# EAGLE design ConFLiCTuino (EAGLE 6.5.0)
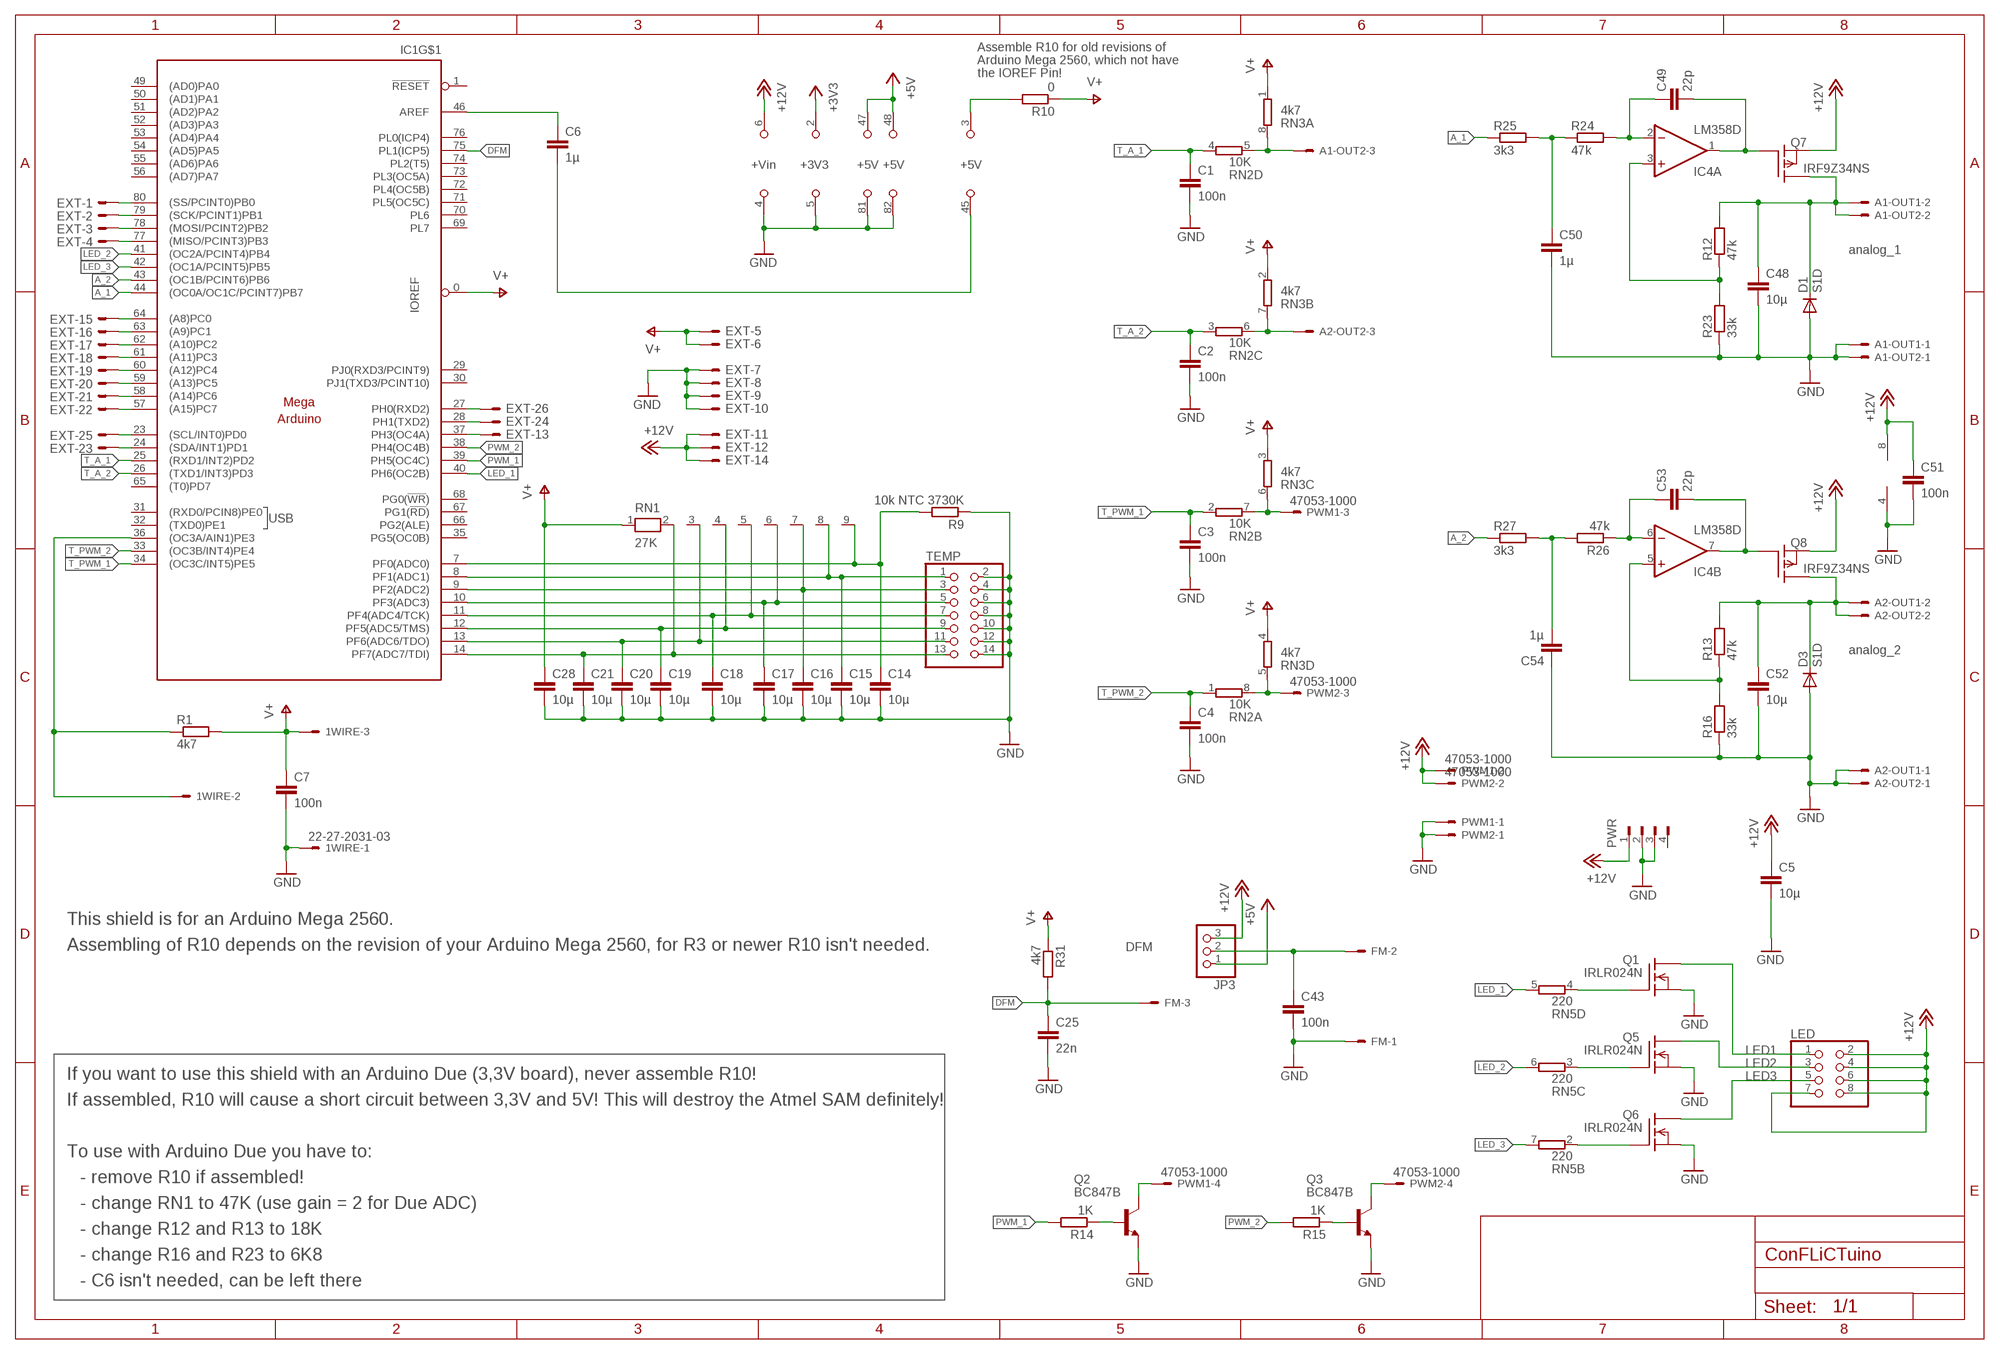
[diagram p0: schematic, sheet 1]

## Parts
1WIRE  22-27-2031-03  [6410-03]
A1-OUT1  22-27-2031-03  [6410-03]
A1-OUT2  22-27-2031-03  [6410-03]
A2-OUT1  22-27-2031-03  [6410-03]
A2-OUT2  22-27-2031-03  [6410-03]
C1  100n  C-EUC0805K  [C0805K]
C2  100n  C-EUC0805K  [C0805K]
C3  100n  C-EUC0805K  [C0805K]
C4  100n  C-EUC0805K  [C0805K]
C5  10µ  C-EUC0805K  [C0805K]
C6  1µ  C-EUC0805K  [C0805K]
C7  100n  C-EUC0805K  [C0805K]
C14  10µ  C-EUC0805K  [C0805K]
C15  10µ  C-EUC0805K  [C0805K]
C16  10µ  C-EUC0805K  [C0805K]
C17  10µ  C-EUC0805K  [C0805K]
C18  10µ  C-EUC0805K  [C0805K]
C19  10µ  C-EUC0805K  [C0805K]
C20  10µ  C-EUC0805K  [C0805K]
C21  10µ  C-EUC0805K  [C0805K]
C25  22n  C-EUC0805K  [C0805K]
C28  10µ  C-EUC0805K  [C0805K]
C43  100n  C-EUC0805K  [C0805K]
C48  10µ  C-EUC0805K  [C0805K]
C49  22p  C-EUC0805K  [C0805K]
C50  1µ  C-EUC0805K  [C0805K]
C51  100n  C-EUC0805K  [C0805K]
C52  10µ  C-EUC0805K  [C0805K]
C53  22p  C-EUC0805K  [C0805K]
C54  1µ  C-EUC0805K  [C0805K]
D1  S1D  DIODE-DO214AC  [DO214AC]
D3  S1D  DIODE-DO214AC  [DO214AC]
EXT  ML26E  [ML26]
FM  22-27-2031-03  [6410-03]
IC1  MEGAARDUINO_CUSTOM  [ARDUINO_MEGA_R3_SMALL_CUSTOM]
IC4  LM358D  [SO08]
JP3  PINHD-1X3  [1X03]
LED  PINHD-2X4  [2X04]
PWM1  47053-1000  [47053-1000]
PWM2  47053-1000  [47053-1000]
PWR  FLOPPY-4350211  [350211]
Q1  IRLR024N  [DPACK]
Q2  BC847B  BC847BSMD  [SOT23]
Q3  BC847B  BC847BSMD  [SOT23]
Q5  IRLR024N  [DPACK]
Q6  IRLR024N  [DPACK]
Q7  IRF9Z34NS  [D2PACK]
Q8  IRF9Z34NS  [D2PACK]
R1  4k7  R-EU_M0805  [M0805]
R9  10k NTC 3730K  R-EU_M0805  [M0805]
R10  0  R-EU_M0805  [M0805]
R12  47k  R-EU_M0805  [M0805]
R13  47k  R-EU_M0805  [M0805]
R14  1K  R-EU_M0805  [M0805]
R15  1K  R-EU_M0805  [M0805]
R16  33k  R-EU_M0805  [M0805]
R23  33k  R-EU_M0805  [M0805]
R24  47k  R-EU_M0805  [M0805]
R25  3k3  R-EU_M0805  [M0805]
R26  47k  R-EU_M0805  [M0805]
R27  3k3  R-EU_M0805  [M0805]
R31  4k7  R-EU_M0805  [M0805]
RN1  27K  RN08  [RN-9]
RN2  10K  4R-NCAT16  [CAT16]
RN3  4k7  4R-NCAT16  [CAT16]
RN5  220  4R-NCAT16  [CAT16]
TEMP  PINHD-2X7  [2X07]

## Nets
+3V3: IC1.2(+3V3)
+5V: IC1.47(+5V) IC1.48(+5V) JP3.1
+12V: C5.1 C51.1 EXT.11 EXT.12 EXT.14 IC1.6(+VIN) IC4.8(P:V+) JP3.3 LED.2 LED.4 LED.6 LED.7 LED.8 PWM1.2 PWM2.2 PWR.1 Q7.3(S) Q8.3(S)
A_1: IC1.44((OC0A/OC1C/PCINT7)PB7) R25.1
A_2: IC1.43((OC1B/PCINT6)PB6) R27.1
DFM: C25.1 FM.3 IC1.75(PL1(ICP5)) R31.2
GND: 1WIRE.1 A1-OUT1.1 A1-OUT2.1 A2-OUT1.1 A2-OUT2.1 C1.2 C2.2 C3.2 C4.2 C5.2 C7.2 C14.2 C15.2 C16.2 C17.2 C18.2 C19.2 C20.2 C21.2 C25.2 C28.2 C43.2 C48.2 C50.2 C51.2 C52.2 C54.1 D1.A D3.A EXT.7 EXT.8 EXT.9 EXT.10 FM.1 IC1.4(GND) IC1.5(GND) IC1.81(GND) IC1.82(GND) IC4.4(P:V-) PWM1.1 PWM2.1 PWR.2 PWR.3 Q1.3(S) Q2.2(E) Q3.2(E) Q5.3(S) Q6.3(S) R9.1 R16.1 R23.1 TEMP.2 TEMP.4 TEMP.6 TEMP.8 TEMP.10 TEMP.12 TEMP.14
LED1: LED.1 Q1.4(D)
LED2: LED.3 Q5.4(D)
LED3: LED.5 Q6.4(D)
LED_1: IC1.40(PH6(OC2B)) RN5.5
LED_2: IC1.41((OC2A/PCINT4)PB4) RN5.6
LED_3: IC1.42((OC1A/PCINT5)PB5) RN5.7
N$1: EXT.23 IC1.24((SDA/INT1)PD1)
N$2: A1-OUT2.3 RN2.5 RN3.8
N$3: A2-OUT1.2 A2-OUT2.2 C52.1 D3.C Q8.2(D) R13.2
N$4: EXT.24 IC1.28(PH1(TXD2))
N$5: A2-OUT2.3 RN2.6 RN3.7
N$6: IC4.3(A:+IN) R12.1 R23.2
N$7: EXT.25 IC1.23((SCL/INT0)PD0)
N$8: C49.2 IC4.1(A:OUT) Q7.1(G)
N$9: EXT.26 IC1.27(PH0(RXD2))
N$10: EXT.22 IC1.57((A15)PC7)
N$11: C43.1 FM.2 JP3.2
N$12: PWM1.3 RN2.7 RN3.6
N$13: EXT.21 IC1.58((A14)PC6)
N$14: PWM2.3 RN2.8 RN3.5
N$15: EXT.20 IC1.59((A13)PC5)
N$16: IC4.5(B:+IN) R13.1 R16.2
N$17: EXT.19 IC1.60((A12)PC4)
N$18: C49.1 IC4.2(A:-IN) R24.2
N$19: Q2.1(B) R14.1
N$20: A1-OUT1.2 A1-OUT2.2 C48.1 D1.C Q7.2(D) R12.2
N$21: Q3.1(B) R15.1
N$22: PWM1.4 Q2.3(C)
N$23: EXT.18 IC1.61((A11)PC3)
N$24: C53.2 IC4.7(B:OUT) Q8.1(G)
N$25: PWM2.4 Q3.3(C)
N$26: EXT.17 IC1.62((A10)PC2)
N$27: EXT.16 IC1.63((A9)PC1)
N$28: EXT.15 IC1.64((A8)PC0)
N$29: EXT.2 IC1.79((SCK/PCINT1)PB1)
N$30: EXT.1 IC1.80((SS/PCINT0)PB0)
N$31: EXT.4 IC1.77((MISO/PCINT3)PB3)
N$32: EXT.3 IC1.78((MOSI/PCINT2)PB2)
N$33: C14.1 IC1.7(PF0(ADC0)) R9.2 RN1.9
N$34: C15.1 IC1.8(PF1(ADC1)) RN1.8 TEMP.1
N$35: C16.1 IC1.9(PF2(ADC2)) RN1.7 TEMP.3
N$36: C17.1 IC1.10(PF3(ADC3)) RN1.6 TEMP.5
N$37: C18.1 IC1.11(PF4(ADC4/TCK)) RN1.5 TEMP.7
N$38: C19.1 IC1.12(PF5(ADC5/TMS)) RN1.4 TEMP.9
N$39: C20.1 IC1.13(PF6(ADC6/TDO)) RN1.3 TEMP.11
N$40: C21.1 IC1.14(PF7(ADC7/TDI)) RN1.2 TEMP.13
N$41: EXT.13 IC1.37(PH3(OC4A))
N$43: C6.1 IC1.46(AREF)
N$44: C6.2 IC1.45(GND)
N$47: 1WIRE.2 IC1.36((OC3A/AIN1)PE3) R1.1
N$52: C50.1 R24.1 R25.2
N$53: C53.1 IC4.6(B:-IN) R26.1
N$54: C54.2 R26.2 R27.2
N$82: Q6.1(G) RN5.2
N$83: Q5.1(G) RN5.3
N$84: Q1.1(G) RN5.4
PWM_1: IC1.39(PH5(OC4C)) R14.2
PWM_2: IC1.38(PH4(OC4B)) R15.2
S$2: IC1.3(+5V) R10.2
T_A_1: C1.1 IC1.25((RXD1/INT2)PD2) RN2.4
T_A_2: C2.1 IC1.26((TXD1/INT3)PD3) RN2.3
T_PWM_1: C3.1 IC1.34((OC3C/INT5)PE5) RN2.2
T_PWM_2: C4.1 IC1.33((OC3B/INT4)PE4) RN2.1
V+: 1WIRE.3 C7.1 C28.1 EXT.5 EXT.6 IC1.0(IOREF) R1.2 R10.1 R31.1 RN1.1 RN3.1 RN3.2 RN3.3 RN3.4
Unconnected: A1-OUT1.3 A2-OUT1.3 IC1.1(!RESET) IC1.29(PJ0(RXD3/PCINT9)) IC1.30(PJ1(TXD3/PCINT10)) IC1.31((RXD0/PCIN8)PE0) IC1.32((TXD0)PE1) IC1.35(PG5(OC0B)) IC1.49((AD0)PA0) IC1.50((AD1)PA1) IC1.51((AD2)PA2) IC1.52((AD3)PA3) IC1.53((AD4)PA4) IC1.54((AD5)PA5) IC1.55((AD6)PA6) IC1.56((AD7)PA7) IC1.65((T0)PD7) IC1.66(PG2(ALE)) IC1.67(PG1(!RD!)) IC1.68(PG0(!WR!)) IC1.69(PL7) IC1.70(PL6) IC1.71(PL5(OC5C)) IC1.72(PL4(OC5B)) IC1.73(PL3(OC5A)) IC1.74(PL2(T5)) IC1.76(PL0(ICP4)) PWR.4 RN5.1 RN5.8

## Notes on the sheet
- Assemble R10 for old revisions of
- Arduino Mega 2560, which not have
- the IOREF Pin!
- analog_1
- USB
- analog_2
- This shield is for an Arduino Mega 2560.
- Assembling of R10 depends on the revision of your Arduino Mega 2560, for R3 or newer R10 isn't needed. | DFM
- If you want to use this shield with an Arduino Due (3,3V board), never assemble R10!
- If assembled, R10 will cause a short circuit between 3,3V and 5V! This will destroy the Atmel SAM definitely!
- To use with Arduino Due you have to:
- - remove R10 if assembled!
- - change RN1 to 47K (use gain = 2 for Due ADC)
- - change R12 and R13 to 18K
- - change R16 and R23 to 6K8
- - C6 isn't needed, can be left there

## Library data of the parts
1WIRE A1-OUT1 A1-OUT2 A2-OUT1 A2-OUT2 FM = con-molex:22-?-03: CONNECTOR wire to board 2.54 mm (.1 inch) pitch header
C1-C7 C14-C21 C25 C28 C43 C48-C54 = rcl:C-EU: CAPACITOR, European symbol
D1 D3 = diode:DIODE-: DIODE
EXT = con-ml:ML26E: HARTING; OC_FARNELL: unknown; OC_NEWARK: unknown
IC1 = arduino:MEGAARDUINO_CUSTOM
IC4 = linear:LM358: OP AMP also LM158; LM258; LM2904 Source: http://cache.national.com/ds/LM/LM158.pdf
JP3 = pinhead:PINHD-1X3: PIN HEADER
LED = pinhead:PINHD-2X4: PIN HEADER
PWM1 PWM2 = con-molex:47053-1000
PWR = con-amp:FLOPPY-4: MATE N-LOCK Floppy / HDD conector Distributor: Bürklin 71F970
Q1 Q5 Q6 = transistor-fet:IRLR024N
Q2 Q3 = transistor-npn:BC847*: NPN Transistor
Q7 Q8 = transistor-fet:IRF9Z34NS
R1 R9 R10 R12-R16 R23-R27 R31 = rcl:R-EU_: RESISTOR, European symbol
RN1 = resistor-net:RN08: RESISTOR NETWORK
RN2 RN3 RN5 = resistor-dil:4R-N: Array Chip Resistor Source: RS Component / Phycomp; OC_FARNELL: unknown; OC_NEWARK: unknown
TEMP = pinhead:PINHD-2X7: PIN HEADER

## Board
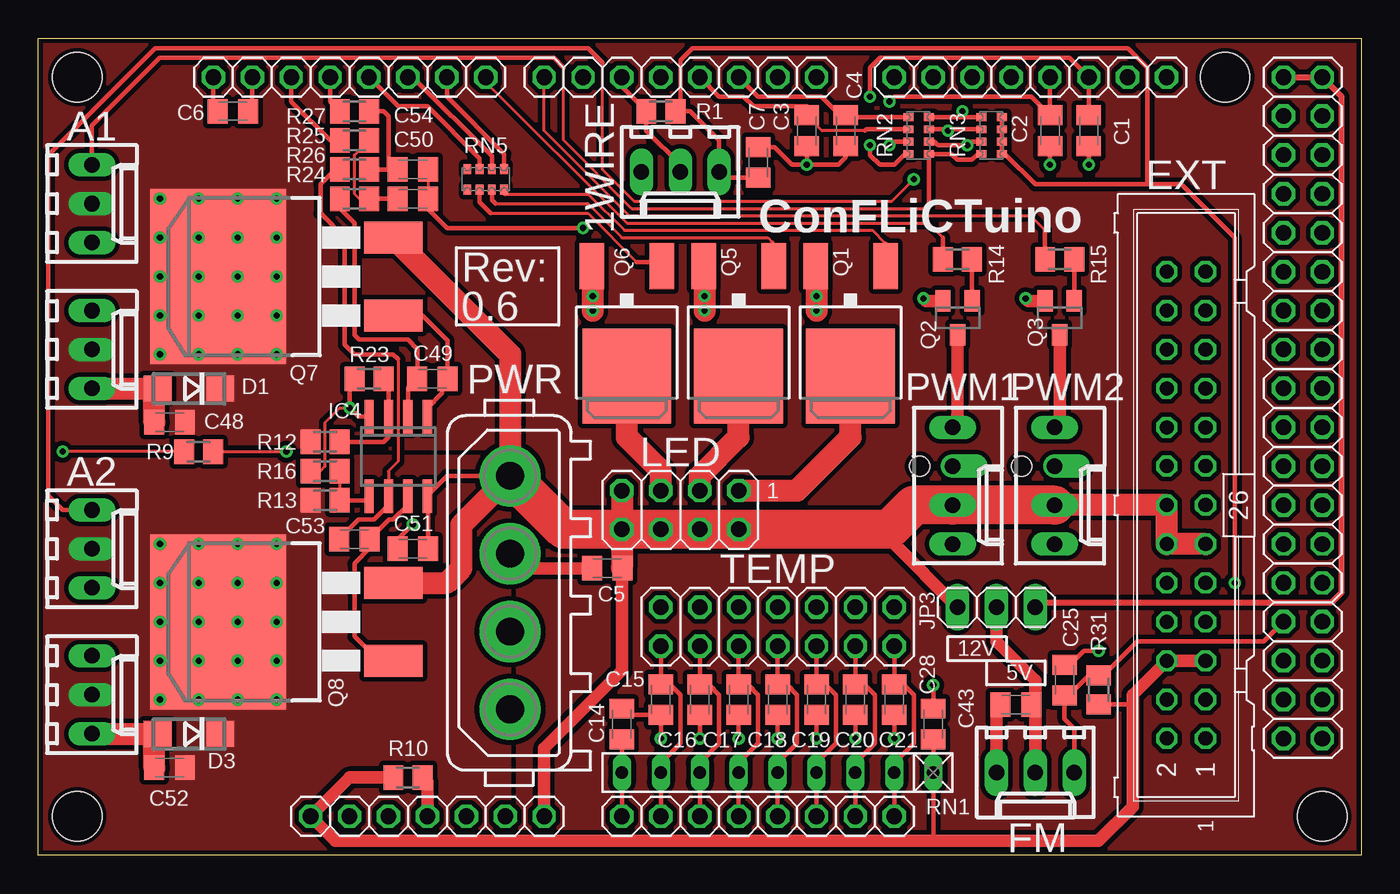
[diagram p1: board, top side]
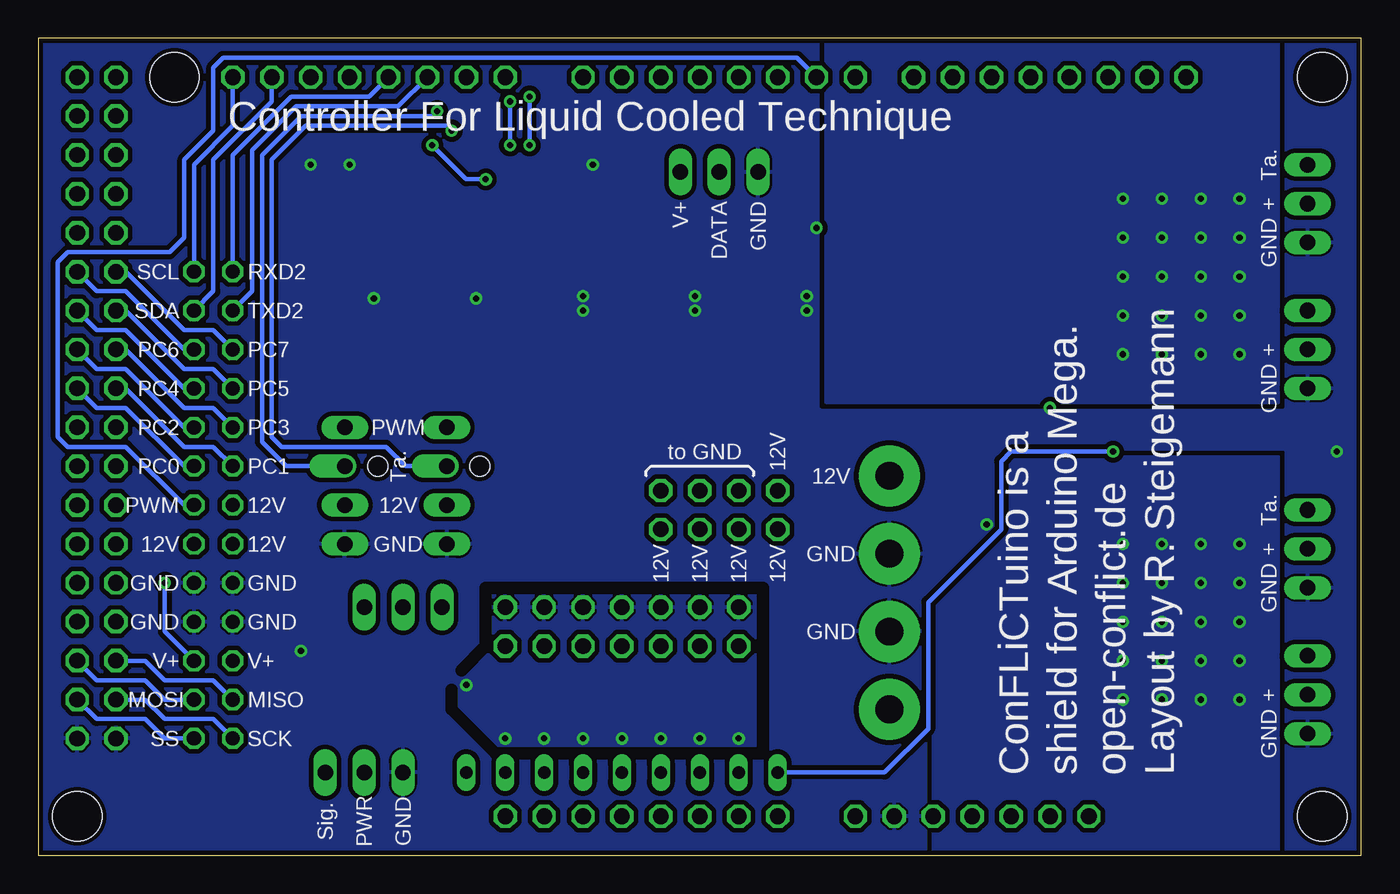
[diagram p2: board, bottom side, seen from below]

Size 86.36 x 53.34 mm. Coordinates in mm from the lower left corner, seen from the top.
Outline: 0,53.34 86.36,53.34 86.36,0 0,0 0,53.34
Copper layers (1*16): Top 0.035mm / dielectric 1.5mm / Bottom 0.035mm
Design rules "platinensammler_03 *": minimum track width 0.15mm, minimum drill 0.3mm, track to track 0.15mm, track to pad 0.15mm, pad to pad 0.15mm, via to via 0.15mm, smd to smd 0mil, copper to edge 0.2mm, drill to drill 0.2mm, minimum pad ring 0.2mm, minimum via ring 0.2mm, stop-mask expansion 2mil, vias tented up to drill 0.8mm, thermal gap 0.15mm
bRestrict: 7 lines

### Footprints (pad centres in the part's own frame; a part is rotated, then mirrored left to right if it is on the bottom)
6410-03 = drill 1.016 long: 1 2.54,0; 2 0,0; 3 -2.54,0
C0805K = smd 1.3 x 1.6: 1 -1,0; 2 1,0
DO214AC = smd 1.8 x 1.7: A 2.05,0; C -2.05,0
ML26 = drill 0.914 octagon: 1 -15.24,-1.27; 2 -15.24,1.27; 3 -12.7,-1.27; 4 -12.7,1.27; 5 -10.16,-1.27; 6 -10.16,1.27; 7 -7.62,-1.27; 8 -7.62,1.27; 9 -5.08,-1.27; 10 -5.08,1.27; 11 -2.54,-1.27; 12 -2.54,1.27; 13 0,-1.27; 14 0,1.27; 15 2.54,-1.27; 16 2.54,1.27; 17 5.08,-1.27; 18 5.08,1.27; 19 7.62,-1.27; 20 7.62,1.27; 21 10.16,-1.27; 22 10.16,1.27; 23 12.7,-1.27; 24 12.7,1.27; 25 15.24,-1.27; 26 15.24,1.27
ARDUINO_MEGA_R3_SMALL_CUSTOM = drill 1.016 octagon: 0 17.78,2.54; 1 20.32,2.54; 2 22.86,2.54; 3 25.4,2.54; 4 27.94,2.54; 5 30.48,2.54; 6 33.02,2.54; 7 38.1,2.54; 8 40.64,2.54; 9 43.18,2.54; 10 45.72,2.54; 11 48.26,2.54; 12 50.8,2.54; 13 53.34,2.54; 14 55.88,2.54; 23 73.66,50.8; 24 71.12,50.8; 25 68.58,50.8; 26 66.04,50.8; 27 63.5,50.8; 28 60.96,50.8; 29 58.42,50.8; 30 55.88,50.8; 31 50.8,50.8; 32 48.26,50.8; 33 45.72,50.8; 34 43.18,50.8; 35 40.64,50.8; 36 38.1,50.8; 37 35.56,50.8; 38 33.02,50.8; 39 29.21,50.8; 40 26.67,50.8; 41 24.13,50.8; 42 21.59,50.8; 43 19.05,50.8; 44 16.51,50.8; 45 13.97,50.8; 46 11.43,50.8; 47 81.28,50.8; 48 83.82,50.8; 49 81.28,48.26; 50 83.82,48.26; 51 81.28,45.72; 52 83.82,45.72; 53 81.28,43.18; 54 83.82,43.18; 55 81.28,40.64; 56 83.82,40.64; 57 81.28,38.1; 58 83.82,38.1; 59 81.28,35.56; 60 83.82,35.56; 61 81.28,33.02; 62 83.82,33.02; 63 81.28,30.48; 64 83.82,30.48; 65 81.28,27.94; 66 83.82,27.94; 67 81.28,25.4; 68 83.82,25.4; 69 81.28,22.86; 70 83.82,22.86; 71 81.28,20.32; 72 83.82,20.32; 73 81.28,17.78; 74 83.82,17.78; 75 81.28,15.24; 76 83.82,15.24; 77 81.28,12.7; 78 83.82,12.7; 79 81.28,10.16; 80 83.82,10.16; 81 81.28,7.62; 82 83.82,7.62 | hole 3.2: 2.54,50.8; 2.54,2.54; 77.47,50.8; 83.82,2.54
SO08 = smd 0.6 x 2.2: 1 -1.905,-2.6; 2 -0.635,-2.6; 3 0.635,-2.6; 4 1.905,-2.6; 5 1.905,2.6; 6 0.635,2.6; 7 -0.635,2.6; 8 -1.905,2.6
1X03 = drill 1.016 long: 1 -2.54,0; 2 0,0; 3 2.54,0
2X04 = drill 1.016 octagon: 1 -3.81,-1.27; 2 -3.81,1.27; 3 -1.27,-1.27; 4 -1.27,1.27; 5 1.27,-1.27; 6 1.27,1.27; 7 3.81,-1.27; 8 3.81,1.27
47053-1000 = drill 1.016 long: 1 3.81,0; 2 1.27,0; 4 -3.81,0 | drill 1.016 offset: 3 -1.27,0 | hole 1.3: -1.27,-2.16
350211 = drill 1.8 pad 4: 1 -7.62,0; 2 -2.54,0; 3 2.54,0; 4 7.62,0
DPACK = smd 1.6 x 3: 1 -2.28,-4.8; 3 2.28,-4.8 | smd 5.8 x 6.2: 4 0,2.38
SOT23 = smd 1 x 1.4: 1 -0.95,-1.1; 2 0.95,-1.1; 3 0,1.1
D2PACK = smd 2.083 x 3.81: 1 -2.54,-8.89; 3 2.54,-8.89 | smd 11.43 x 8.89: 2 0,2.54
M0805 = smd 1.3 x 1.6: 1 -0.95,0; 2 0.95,0
RN-9 = drill 0.813 long: 1 -10.16,0; 2 -7.62,0; 3 -5.08,0; 4 -2.54,0; 5 0,0; 6 2.54,0; 7 5.08,0; 8 7.62,0; 9 10.16,0
CAT16 = smd 0.5 x 0.65: 1 -1.2,-0.675; 2 -0.4,-0.675; 3 0.4,-0.675; 4 1.2,-0.675; 5 1.2,0.675; 6 0.4,0.675; 7 -0.4,0.675; 8 -1.2,0.675
2X07 = drill 1.016 octagon: 1 -7.62,-1.27; 2 -7.62,1.27; 3 -5.08,-1.27; 4 -5.08,1.27; 5 -2.54,-1.27; 6 -2.54,1.27; 7 0,-1.27; 8 0,1.27; 9 2.54,-1.27; 10 2.54,1.27; 11 5.08,-1.27; 12 5.08,1.27; 13 7.62,-1.27; 14 7.62,1.27

### Placement (x,y rotation side)
1WIRE  41.91,44.61 180 top
A1-OUT1  3.49,33.02 270 top
A1-OUT2  3.49,42.55 270 top
A2-OUT1  3.49,10.48 270 top
A2-OUT2  3.49,20 270 top
C1  68.58,47.31 270 top
C2  66.04,47.31 270 top
C3  50.16,47.31 270 top
C4  52.7,47.31 270 top
C5  37.15,18.73 180 top
C6  12.7,48.58 0 top
C7  46.99,45.24 90 top
C14  38.1,8.57 90 top
C15  40.64,10.16 270 top
C16  43.18,10.16 270 top
C17  45.72,10.16 270 top
C18  48.26,10.16 270 top
C19  50.8,10.16 270 top
C20  53.34,10.16 270 top
C21  55.88,10.16 270 top
C25  66.99,11.43 90 top
C28  58.42,8.57 90 top
C43  63.82,9.84 180 top
C48  8.57,28.26 180 top
C49  25.72,31.11 0 top
C50  24.45,42.86 0 top
C51  24.45,20 180 top
C52  8.57,5.71 180 top
C53  20.64,20.64 0 top
C54  24.45,44.77 180 top
D1  9.84,30.48 180 top
D3  9.84,7.94 180 top
EXT  74.93,22.86 90 top
FM  65.09,5.4 180 top
IC1  0,0 0 top
IC4  23.5,26.04 180 top
JP3  62.55,16.19 180 top
LED  41.91,22.54 180 top
PWM1  59.69,24.13 270 top
PWM2  66.36,24.13 270 top
PWR  30.8,17.14 270 top
Q1  53.02,33.66 180 top
Q2  60.01,35.08 180 top
Q3  66.67,35.08 180 top
Q5  45.72,33.66 180 top
Q6  38.42,33.66 180 top
Q7  14.29,37.78 90 top
Q8  14.29,15.24 90 top
R1  40.64,48.58 0 top
R9  10.48,26.35 0 top
R10  24.13,5.08 0 top
R12  18.73,26.99 180 top
R13  18.73,23.18 180 top
R14  60.01,38.89 180 top
R15  66.67,38.89 180 top
R16  18.73,25.08 0 top
R23  21.59,31.11 0 top
R24  20.64,42.86 180 top
R25  20.64,46.67 0 top
R26  20.64,44.77 0 top
R27  20.64,48.58 0 top
R31  69.22,10.79 90 top
RN1  48.26,5.4 180 top
RN2  57.47,46.99 270 top
RN3  62.23,46.99 90 top
RN5  29.21,44.13 0 top
TEMP  48.26,14.92 0 top

### Tracks (layer width: path | path; a pad name or v marks a point on that pad's centre or on a via)
+5V
  Top 0.406: JP3.1 65.09,16.51 84.45,16.51 85.09,17.14 85.09,49.53 IC1.48 IC1.47
+12V
  Top 0.305: PWR.1 26.67,24.77 25.4,23.5 IC4.8 25.45,23.39 C51.1
  Top 0.813: IC1.6 33.02,6.99 38.1,12.06 38.1,18.68 C5.1 38.1,18.78 | JP3.3 55.72,20.48 55.72,21.11 55.56,21.27
  Top 1.422: Q8.3 26.67,17.78 27.62,18.73 27.62,21.59 PWR.1 30.8,32.7 Q7.3 | LED.7 LED.8 38.1,18.78 | EXT.11 EXT.12 EXT.14 PWM2.2
  Top 2.54: PWM2.2 PWM1.2 57.15,22.86 55.56,21.27 LED.2 LED.4 LED.6 LED.8 34.29,21.27 PWR.1
A_1
  Top 0.305: IC1.44 16.51,49.21 19.05,46.67 R25.1
A_2
  Top 0.305: IC1.43 19.05,49.22 R27.1
DFM
  Top 0.305: FM.3 67.63,8.26 66.99,8.89 C25.1 67.26,10.43 68.58,11.75 R31.2 69.53,11.74 71.75,13.97 80.01,13.97 IC1.75
GND  (via drill 0.4)
  Top 0.203: R16.1 18.41,25.08 18.73,25.4 18.73,28.26 19.68,29.21 v20.32,29.21 | R9.1 v1.59,26.35 | C54.1 C50.2
  Top 0.305: v40.64,7.62 C15.2 38.51,9.16 C14.2 | C16.2 v43.18,7.62 | C17.2 v45.72,7.62 | C18.2 v48.26,7.62 | C19.2 v50.8,7.62 | C20.2 v53.34,7.62 | C21.2 v55.88,7.62 | C28.2 v58.42,11.11 | IC4.4 20.89,28.64 v20.32,29.21 20.32,30.48 20.95,31.11 R23.1 | C25.2 67.36,12.43 68.26,13.34 v69.22,13.34 | C3.2 v50.16,45.09 | C2.2 v66.04,45.09 | C1.2 v68.58,45.09 | v24.45,21.59 23.5,20.64 23.5,20.05 C51.2 | C50.2 25.45,42.18 26.67,40.96 v35.56,40.96 | C7.2 48.05,46.24 49.21,45.09 v50.16,45.09 | C4.2 52.7,45.56 52.23,45.09 v50.16,45.09
  Top 0.813: C43.2 62.55,9.84 FM.1 | Q2.2 57.95,36.18 v57.78,36.35 | Q3.2 64.62,36.18 v64.45,36.35 | C5.2 31.75,18.73 PWR.2
  Top 1.422: A1-OUT1.1 7.3,30.48 | 7.3,30.48 D1.A | C48.2 7.57,30.21 7.3,30.48 | A2-OUT1.1 7.3,7.94 | 7.3,7.94 D3.A | C52.2 7.57,7.67 7.3,7.94 | Q6.3 36.2,38.45 v36.2,36.51 v36.2,35.56 | Q5.3 43.5,38.45 v43.5,36.51 v43.5,35.56 | Q1.3 50.8,38.45 v50.8,36.51 v50.8,35.56
  pour Bottom (isolate 0.305, rank 6): 0,53.34 86.36,53.34 86.36,0 0,0
LED1
  Top 1.422: LED.1 49.53,23.81 53.02,27.3 Q1.4
LED2
  Top 1.422: LED.3 43.18,24.77 45.72,27.3 Q5.4
LED3
  Top 1.422: LED.5 40.64,25.08 38.42,27.3 Q6.4
LED_1
  Top 0.305: RN5.5 30.41,45.79 26.67,49.53 IC1.40
LED_2
  Top 0.305: RN5.6 29.61,45.64 24.45,50.8 IC1.41
LED_3
  Top 0.305: IC1.42 23.5,48.9 25.4,48.9 28.81,45.48 RN5.7
N$1
  Bottom 0.305: EXT.23 74.93,36.83 74.93,45.4 71.12,49.21 IC1.24
N$2
  Top 0.203: 34.29,51.44 34.29,46.67 38.73,42.23 57.78,42.23 58.14,42.59
  Top 0.305: A1-OUT2.3 3.49,47.62 7.94,52.07 33.66,52.07 34.29,51.44 | RN3.8 61.35,45.79 60.96,45.4 60.01,45.4 59.62,45.79 RN2.5 58.14,42.59
N$3  (via drill 0.4)
  other vias: 15.56,15.24 15.56,12.7 15.56,10.16 15.56,17.78 15.56,20.32 13.02,20.32 10.48,20.32 7.94,20.32 13.02,17.78 13.02,15.24 13.02,12.7 13.02,10.16 10.48,17.78 10.48,15.24 10.48,12.7 10.48,10.16 7.94,17.78 7.94,15.24 7.94,12.7 7.94,10.16
  pour Top (isolate 0.305, rank 2, no thermals): 0,0 30.8,0 30.8,26.04 0,26.04
  pour Bottom (isolate 0.305, rank 2, no thermals): 5.4,0 27.94,0 27.94,16.19 23.18,20.95 23.18,26.04 5.4,26.04
N$4
  Bottom 0.305: IC1.28 62.87,48.9 69.53,48.9 72.39,46.04 72.39,36.83 EXT.24
N$5  (via drill 0.4)
  Top 0.203: v57.15,44.13 55.72,42.7 38.89,42.7 36.83,44.77 36.83,51.75
  Top 0.305: A2-OUT2.3 1.59,22.54 0.64,23.5 0.64,45.72 7.62,52.7 35.88,52.7 36.83,51.75 | RN3.7 60.88,46.59 v60.64,46.35 58.74,46.35 58.5,46.59 RN2.6
  Bottom 0.305: v57.15,44.13 58.42,44.13 v60.64,46.35
N$6
  Top 0.305: R12.1 22.54,26.99 22.86,27.3 IC4.3 22.86,31.11 R23.2
N$7
  Bottom 0.305: IC1.23 73.66,47.62 76.2,45.09 EXT.25
N$8
  Top 0.305: IC4.1 25.4,29.21 26.35,30.16 26.35,30.75 C49.2 26.72,33.61 25.08,35.24 Q7.1
N$9
  Bottom 0.305: EXT.26 73.66,45.72 69.85,49.53 64.77,49.53 IC1.27
N$10
  Bottom 0.305: EXT.22 74.93,34.29 76.83,34.29 80.64,38.1 IC1.57
N$11
  Top 0.813: FM.2 65.09,9.57 C43.1 65.09,10.11 65.09,11.43 62.55,13.97 JP3.2
N$12  (via drill 0.4)
  Top 0.305: RN2.7 59.29,47.39 v59.37,47.31 59.45,47.39 RN3.6
  Bottom 0.305: PWM1.3 62.39,25.4 63.66,26.67 70.48,26.67 71.12,27.3 71.12,45.4 68.9,47.62 59.69,47.62 v59.37,47.31
N$13
  Bottom 0.305: EXT.21 76.83,33.02 80.64,36.83 82.55,36.83 IC1.58
N$14  (via drill 0.4)
  Top 0.305: RN2.8 60.33,48.19 | 60.33,48.19 RN3.5 | v60.33,48.58 60.33,48.19
  Bottom 0.305: PWM2.3 70.17,25.4 71.75,26.99 71.75,45.72 69.22,48.26 60.64,48.26 v60.33,48.58
N$15
  Bottom 0.305: EXT.20 74.93,31.75 76.83,31.75 80.64,35.56 IC1.59
N$16
  Top 0.203: R16.2 R13.1
  Top 0.305: R13.1 21.33,23.18 IC4.5
N$17
  Bottom 0.305: EXT.19 76.83,30.48 80.64,34.29 82.55,34.29 IC1.60
N$18
  Top 0.305: IC4.2 24.13,30.53 C49.1 24.77,31.16 24.77,33.02 24.13,33.66 20.95,33.66 20.64,33.97 20.64,41.27 19.69,42.23 R24.2
N$19
  Top 0.305: Q2.1 R14.1
N$20  (via drill 0.4)
  other vias: 15.56,37.78 15.56,40.32 15.56,42.86 15.56,35.24 15.56,32.7 13.02,32.7 10.48,32.7 7.94,32.7 13.02,35.24 13.02,37.78 13.02,40.32 13.02,42.86 10.48,35.24 10.48,37.78 10.48,40.32 10.48,42.86 7.94,35.24 7.94,37.78 7.94,40.32 7.94,42.86
  pour Top (isolate 0.305, rank 2, no thermals): 0,53.34 0,26.67 20.64,26.67 20.64,53.34
  pour Bottom (isolate 0.305, rank 2, no thermals): 5.4,53.34 5.4,29.53 34.92,29.53 34.92,53.34
N$21
  Top 0.305: Q3.1 R15.1
N$22
  Top 0.813: Q2.3 60.01,28.26 PWM1.4
N$23
  Bottom 0.305: EXT.18 74.93,29.21 76.83,29.21 80.64,33.02 IC1.61
N$24
  Top 0.305: Q8.1 22.23,12.7 20.64,14.29 20.64,19.05 21.64,20.05 C53.2 22.91,21.91 23.18,21.91 24.13,22.86 IC4.7
N$25
  Top 0.813: Q3.3 66.67,28.26 PWM2.4
N$26
  Bottom 0.305: EXT.17 76.83,27.94 80.64,31.75 82.55,31.75 IC1.62
N$27
  Bottom 0.305: EXT.16 74.93,26.67 76.83,26.67 80.64,30.48 IC1.63
N$28
  Bottom 0.305: EXT.15 76.83,25.4 80.64,29.21 82.55,29.21 IC1.64
N$29
  Bottom 0.305: EXT.2 74.93,8.89 78.11,8.89 79.38,10.16 IC1.79
N$30
  Bottom 0.305: EXT.1 78.11,7.62 79.38,8.89 82.55,8.89 IC1.80
N$31
  Bottom 0.305: EXT.4 74.93,11.43 78.11,11.43 79.38,12.7 IC1.77
N$32
  Bottom 0.305: EXT.3 78.11,10.16 79.38,11.43 82.55,11.43 IC1.78
N$33  (via drill 0.4)
  Top 0.203: R9.2 v16.19,26.35
  Top 0.305: IC1.7 RN1.9 C14.1
  Bottom 0.305: v16.19,26.35 22.86,26.35 23.5,25.72 23.5,21.27 28.26,16.51 28.26,8.26 31.11,5.4 RN1.9
N$34
  Top 0.305: TEMP.1 C15.1 40.69,11.11 41.27,11.11 41.91,10.48 41.91,7.3 40.64,6.03 RN1.8 IC1.8
N$35
  Top 0.305: TEMP.3 C16.1 43.23,11.11 43.81,11.11 44.45,10.48 44.45,7.3 43.18,6.03 RN1.7 IC1.9
N$36
  Top 0.305: TEMP.5 C17.1 45.77,11.11 46.35,11.11 46.99,10.48 46.99,7.3 45.72,6.03 RN1.6 IC1.10
N$37
  Top 0.305: IC1.11 RN1.5 48.26,6.03 49.53,7.3 49.53,10.48 48.9,11.11 48.31,11.11 C18.1 TEMP.7
N$38
  Top 0.305: IC1.12 RN1.4 50.8,6.03 52.07,7.3 52.07,10.48 51.44,11.11 50.85,11.11 C19.1 TEMP.9
N$39
  Top 0.305: IC1.13 RN1.3 53.34,6.03 54.61,7.3 54.61,10.48 53.98,11.11 53.39,11.11 C20.1 TEMP.11
N$40
  Top 0.305: IC1.14 RN1.2 55.88,6.03 57.15,7.3 57.15,10.48 56.52,11.11 55.93,11.11 C21.1 TEMP.13
N$41
  Bottom 0.305: EXT.13 76.83,22.86 80.64,26.67 84.45,26.67 85.09,27.3 85.09,38.73 84.45,39.37 77.79,39.37 76.83,40.32 76.83,45.4 74.93,47.31 74.93,51.44 74.3,52.07 36.83,52.07 IC1.37
N$43
  Top 0.305: IC1.46 11.43,48.85 C6.1
N$44
  Top 0.305: IC1.45 13.97,48.85 C6.2
N$45
  pour Top (isolate 0.305, rank 6): 86.36,0 86.36,53.34 20.64,53.34 20.64,26.04 30.48,26.04 30.48,0
N$47
  Top 0.305: 1WIRE.2 41.91,45.09 39.69,47.31 R1.1 38.1,50.17 IC1.36
N$52
  Top 0.203: R24.1 20.95,42.86 20.64,43.18 20.64,45.72 R25.2
  Top 0.305: R24.1 C50.1
N$53
  Top 0.203: 23.5,32.38 23.5,25.72 22.86,25.08 IC4.6
  Top 0.305: R26.1 19.37,44.77 18.41,43.81 18.41,41.91 20,40.32 20,33.34 20.64,32.7 23.18,32.7 23.5,32.38 | IC4.6 22.86,22.86 21.91,21.91 20.91,21.91 C53.1
N$54
  Top 0.305: R26.2 22.86,44.77 | 22.86,44.77 C54.2 | R27.2 22.54,48.58 22.86,48.26 22.86,44.77
N$82
  Top 0.203: 29.53,41.91 35.88,41.91 39.05,38.73
  Top 0.305: RN5.2 28.81,42.63 29.53,41.91 | 39.05,38.73 40.42,38.73 Q6.1
N$83
  Top 0.203: 29.84,42.55 35.88,42.55 38.1,40.32 47.62,40.32 47.94,40.01
  Top 0.305: RN5.3 29.61,42.78 29.84,42.55 | 47.96,38.42 Q5.1 47.94,38.51 47.94,40.01
N$84
  Top 0.203: 30.48,43.18 35.88,43.18 38.26,40.8 54.45,40.8 55.3,39.95
  Top 0.305: RN5.4 30.41,43.25 30.48,43.18 | Q1.1 55.3,39.95
PWM_1
  Top 0.203: 59.05,40.32 58.1,41.27 38.42,41.27 29.21,50.48
  Top 0.305: 29.21,50.48 IC1.39 | 59.05,40.32 R14.2
PWM_2
  Top 0.203: 65.72,40.8 64.77,41.75 38.58,41.75 33.02,47.31 IC1.38
  Top 0.305: 65.72,40.8 R15.2
S$2
  Top 0.813: IC1.3 25.4,4.76 R10.2
T_A_1  (via drill 0.4)
  Top 0.305: C1.1 IC1.25 67.31,52.07 54.93,52.07 54.29,51.44 v54.29,49.53 | RN2.4 56.59,45.79 55.88,45.09 54.93,45.09 54.29,45.72 v54.29,46.35
  Bottom 0.305: v54.29,46.35 v54.29,49.53
T_A_2  (via drill 0.4)
  Top 0.305: IC1.26 C2.1 64.82,49.53 55.88,49.53 v55.56,49.21 | RN2.3 55.8,46.59 v55.56,46.35
  Bottom 0.305: v55.56,46.35 v55.56,49.21
T_PWM_1
  Top 0.203: 53.98,47.31 51.16,47.31 C3.1
  Top 0.305: RN2.2 54.06,47.39 53.98,47.31 | IC1.34 44.45,49.53 46.04,49.53 46.67,48.9 50.16,48.9 C3.1
T_PWM_2
  Top 0.305: RN2.1 52.82,48.19 C4.1 52.34,48.31 51.12,49.53 46.99,49.53 IC1.33
V+  (via drill 0.4)
  Top 0.305: 58.42,0.95 RN1.1 C28.1 | R31.1 71.44,9.85 71.44,9.84 | 72.39,43.81 65.09,43.81 63.11,45.79 RN3.1 RN3.2 RN3.3 RN3.4 | 72.39,43.81 74.61,43.81 78.11,40.32 v78.11,17.78 | R1.2 41.91,48.58 | 41.91,48.58 41.91,51.91 42.7,52.7 71.12,52.7 72.39,51.44 72.39,43.81 | 41.91,48.58 42.55,48.58 44.45,46.67 1WIRE.3 44.81,44.24 C7.1
  Top 0.813: EXT.5 EXT.6 71.44,10.48 71.44,9.84 71.44,3.17 69.22,0.95 58.42,0.95 19.37,0.95 IC1.0 20.32,5.08 R10.1
  Bottom 0.305: v78.11,17.78 78.11,14.61 EXT.5

### Text on the board
tPlace: 12V | 5V
tNames: A1 | ConFLiCTuino | Rev: | 0.6 | A2 | 1 | 1
bNames: Controller For Liquid Cooled Technique | Ta. | + | GND | DATA | V+ | GND | RXD2 | SCL | TXD2 | SDA | + | PC7 | PC6 | GND | PC5 | PC4 | PWM | PC3 | PC2 | 12V | to GND | 12V | Ta. | PC1 | PC0 | Ta. | 12V | 12V | PWM | + | GND | GND | 12V | 12V | 12V | 12V | 12V | 12V | GND | GND | GND | GND | GND | GND | V+ | V+ | + | MISO | MOSI | GND | SCK | SS | Layout by R. Steigemann | open-conflict.de | shield for Arduino Mega. | ConFLiCTuino is a | GND | PWR | Sig.